# Altium schematic sheet Power.SchDoc
size A4
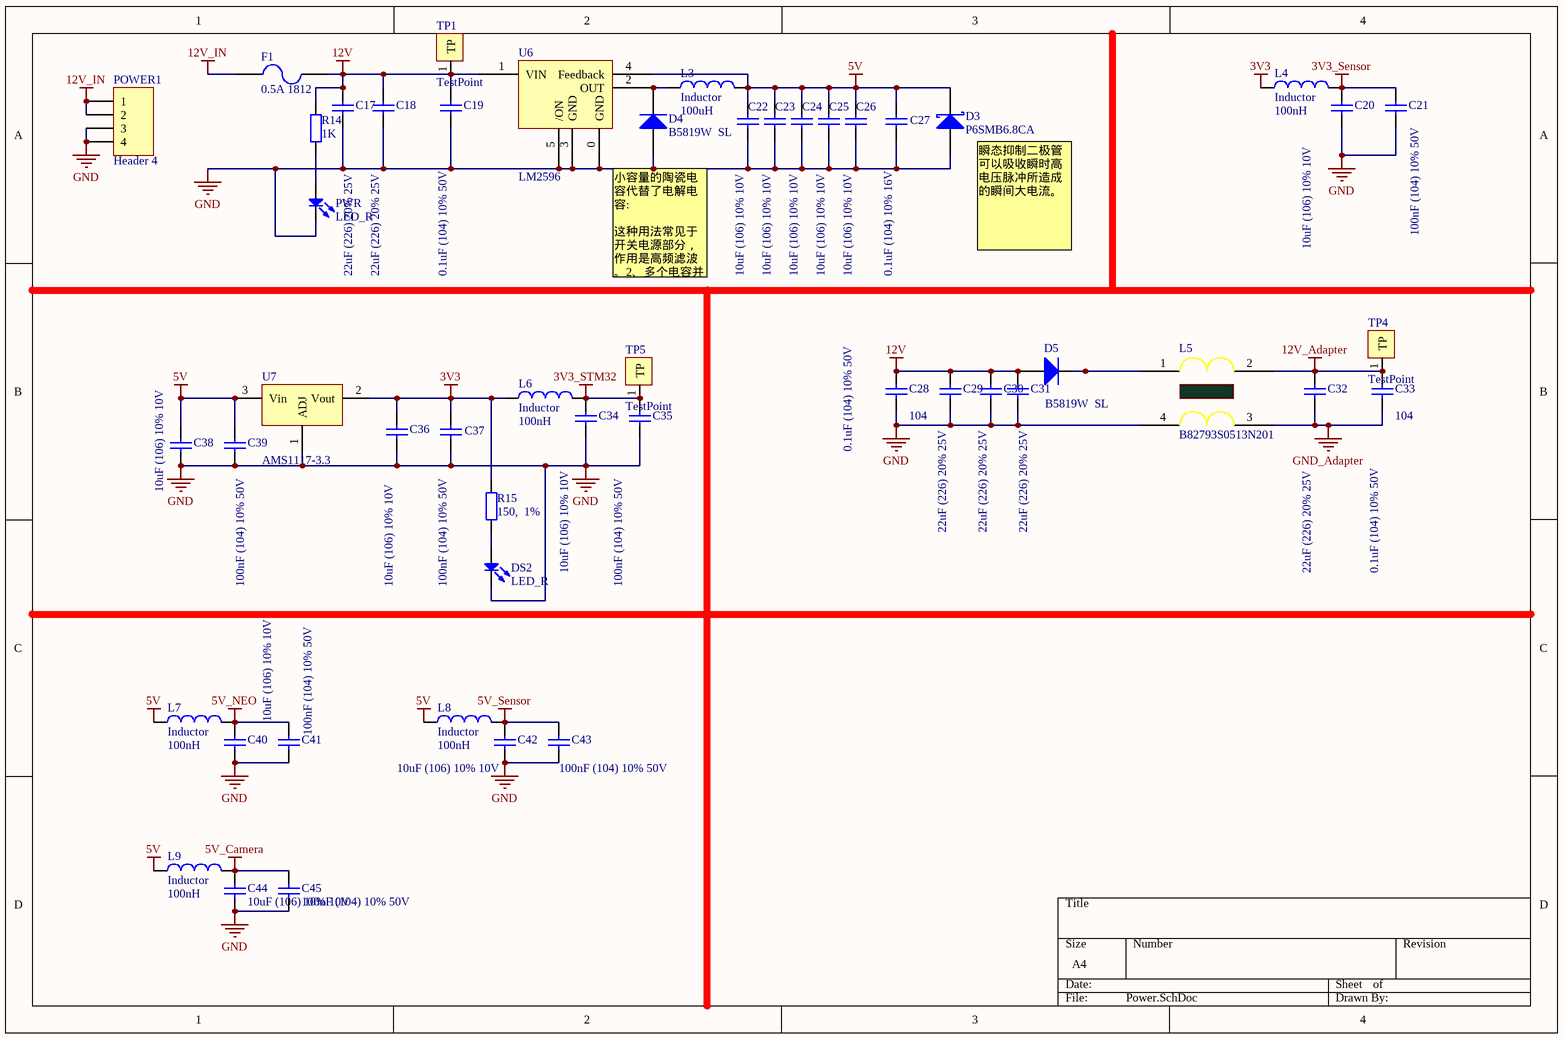
[diagram p0: Power.SchDoc]

## Parts
C17  22uF (226) 20% 25V  [0805_C]
C18  22uF (226) 20% 25V  [0805_C]
C19  0.1uF (104) 10% 50V  [0805_C]
C20  10uF (106) 10% 10V  [0603_C]
C21  100nF (104) 10% 50V  [0603_C]
C22  10uF (106) 10% 10V  [0603_C]
C23  10uF (106) 10% 10V  [0603_C]
C24  10uF (106) 10% 10V  [0603_C]
C25  10uF (106) 10% 10V  [0603_C]
C26  10uF (106) 10% 10V  [0603_C]
C27  0.1uF (104) 10% 16V  [0603_C]
C28  0.1uF (104) 10% 50V  value 104  [0805_C]
C29  22uF (226) 20% 25V  [0805_C]
C30  22uF (226) 20% 25V  [0805_C]
C31  22uF (226) 20% 25V  [0805_C]
C32  22uF (226) 20% 25V  [0805_C]
C33  0.1uF (104) 10% 50V  value 104  [0805_C]
C34  10uF (106) 10% 10V  [0603_C]
C35  100nF (104) 10% 50V  [0603_C]
C36  10uF (106) 10% 10V  [0603_C]
C37  100nF (104) 10% 50V  [0603_C]
C38  10uF (106) 10% 10V  [0603_C]
C39  100nF (104) 10% 50V  [0603_C]
C40  10uF (106) 10% 10V  [0603_C]
C41  100nF (104) 10% 50V  [0603_C]
C42  10uF (106) 10% 10V  [0603_C]
C43  100nF (104) 10% 50V  [0603_C]
C44  10uF (106) 10% 10V  [0603_C]
C45  100nF (104) 10% 50V  [0603_C]
D3  P6SMB6.8CA  [SMB(DO-214AA)_S1]
D4  B5819W  SL  [SOD-123]
D5  B5819W  SL  [SOD-123]
DS2  LED_R  [LED0603]
F1  0.5A 1812  [1812]
L3  Inductor  value 100uH  [L1050(10x10x4)]
L4  Inductor  value 100nH  [0603_L]
L5  B82793S0513N201  [B82793S0513N201_Yes]
L6  Inductor  value 100nH  [0603_L]
L7  Inductor  value 100nH  [0603_L]
L8  Inductor  value 100nH  [0603_L]
L9  Inductor  value 100nH  [0603_L]
POWER1  Header 4  [XH2.54_4P]
PWR  LED_R  [LED0603]
R14  1K  [R0603]
R15  150,  1%  [R0603]
TP1  TestPoint  [TP]
TP4  TestPoint  [TP]
TP5  TestPoint  [TP]
U6  LM2596
U7  AMS1117-3.3  [SOT-223]

## Nets
3V3: C36.2 C37.2 L4.1 L6.1 R15.1 U7.2(Vout)
3V3_Sensor: C20.2 C21.2 L4.2
3V3_STM32: C34.2 C35.2 L6.2 TP5.1(TP)
5V: C22.2 C23.2 C24.2 C25.2 C26.2 C27.2 C38.2 C39.2 D3.2(K) L3.2 L7.1 L8.1 L9.1 U6.4(Feedback) U7.3(Vin)
5V_Camera: C44.2 C45.2 L9.2
5V_NEO: C40.2 C41.2 L7.2
5V_Sensor: C42.2 C43.2 L8.2
12V: C17.2 C18.2 C19.2 C28.2 C29.2 C30.2 C31.2 D5.1(A) F1.2 R14.1 TP1.1(TP) U6.1(VIN)
12V_Adapter: C32.2 C33.2 L5.2 TP4.1(TP)
12V_IN: F1.1 POWER1.1 POWER1.2
GND: C17.1 C18.1 C19.1 C20.1 C21.1 C22.1 C23.1 C24.1 C25.1 C26.1 C27.1 C28.1 C29.1 C30.1 C31.1 C34.1 C35.1 C36.1 C37.1 C38.1 C39.1 C40.1 C41.1 C42.1 C43.1 C44.1 C45.1 D3.1(A) D4.1(A) DS2.2(K) L5.4 POWER1.3 POWER1.4 PWR.2(K) U6.0(GND) U6.3(GND) U6.5(/ON) U7.1(ADJ)
GND_Adapter: C32.1 C33.1 L5.3
NetD4_2: D4.2(K) L3.1 U6.2(OUT)
NetD5_2: D5.2(K) L5.1
NetDS2_1: DS2.1(A) R15.2
NetPWR_1: PWR.1(A) R14.2

## Notes on the sheet
- (near D3) 瞬态抑制二极管
  可以吸收瞬时高电压脉冲所造成的瞬间大电流。
- 小容量的陶瓷电容代替了电解电容:
  这种用法常见于开关电源部分，作用是高频滤波。2、多个电容并联主要是为了降低电容的等效阻抗，因为并联。3、用小容量的陶瓷电容代替了电解电容，增加了寿命。4、电解电容的寿命只有几千小时，而陶瓷电容的寿命有几十万小时。5、防止趋附效应的原理是增加导线的表面积。6、多个电容只能降低线路可靠性，而不可能增加。

## Library data of the parts
C17 C18 C29-C32 = 0805 22uF (226) 20% 25V: 贴片电容; ComponentLink1Description: 供应商链接; ComponentLink1URL: http://www.szlcsc.com/product/details_46786.html; Package: 0805; Supplier: LC; SuppliersPartNumber: C45783
C19 C27 C28 C33 = Cap: Capacitor; Published: 8-Jun-2000; LatestRevisionDate: 17-Jul-2002; LatestRevisionNote: Re-released for DXP Platform.; PackageReference: RAD-0.3; Publisher: Altium Limited; PackageDescription: Radial Cap, Thru-Hole; 2 Leads; 0.3 in Pin Spacing
C20 C22-C26 C34 C36 C38 C40 C42 C44 = 0603 10uF (106) 10% 10V: 贴片电容; ComponentLink1Description: 供应商链接; ComponentLink1URL: http://www.szlcsc.com/product/details_20411.html; Package: 0603; Supplier: LC; SuppliersPartNumber: C19702
C21 C35 C37 C39 C41 C43 C45 = 0603 100nF (104) 10% 50V: 贴片电容; ComponentLink1Description: 供应商链接; ComponentLink1URL: http://www.szlcsc.com/product/details_15331.html; Package: 0603; Supplier: LC; SuppliersPartNumber: C14663
D3 = D Schottky: Schottky Diode; Published: 8-Jun-2000; LatestRevisionDate: 17-Jul-2002; LatestRevisionNote: Re-released for DXP Platform.; PackageReference: SMB; Publisher: Altium Limited; PackageDescription: DO-214-AA/SMB; 2 C-Bend Leads; Body 5.3 x 3.6 mm, inc. leads (LxW); Code_JEDEC: DO-214-AA
D4 D5 = SOD-123 B5819W  SL: 肖特基二极管; ComponentLink1Description: 供应商链接; ComponentLink1URL: http://www.szlcsc.com/product/details_9093.html; Package: SOD-123; Supplier: LC; SuppliersPartNumber: C8598
DS2 PWR = LED: Typical RED, GREEN, YELLOW, AMBER GaAs LED; Published: 8-Jun-2000; LatestRevisionDate: 17-Jul-2002; LatestRevisionNote: Re-released for DXP Platform.; PackageDocument: Feb-2002; PackageReference: 3.2X1.6X1.1; Publisher: Altium Limited
F1 = Fuse 2: Fuse; Published: 8-Jun-2000; LatestRevisionDate: 17-Jul-2002; LatestRevisionNote: Re-released for DXP Platform.; PackageReference: PIN-W2/E2.8; Publisher: Altium Limited; PackageDescription: Thru-Hole; 2 Leads
L3 L4 L6-L9 = Inductor: Code_IEC: 1005; Published: 8-Jun-2000; LatestRevisionDate: 29-May-2009; LatestRevisionNote: IPC-7351 Footprint Added.; PackageReference: 0402-A; Publisher: Altium Limited; PackageDescription: Chip Inductor; Code_JEITA: 0402
POWER1 = Header 4: Header, 4-Pin; LatestRevisionDate: 17-Jul-2002; LatestRevisionNote: Re-released for DXP Platform.; Publisher: Altium Limited
R14 R15 = Res2: Resistor; Published: 8-Jun-2000; LatestRevisionDate: 17-Jul-2002; LatestRevisionNote: Re-released for DXP Platform.; Publisher: Altium Limited
TP1 TP4 TP5 = TP
U6 = LM2576
U7 = LM317: 3-Terminal Adjustable Positive Voltage Regulator